# EAGLE schematic main (EAGLE 5.11)
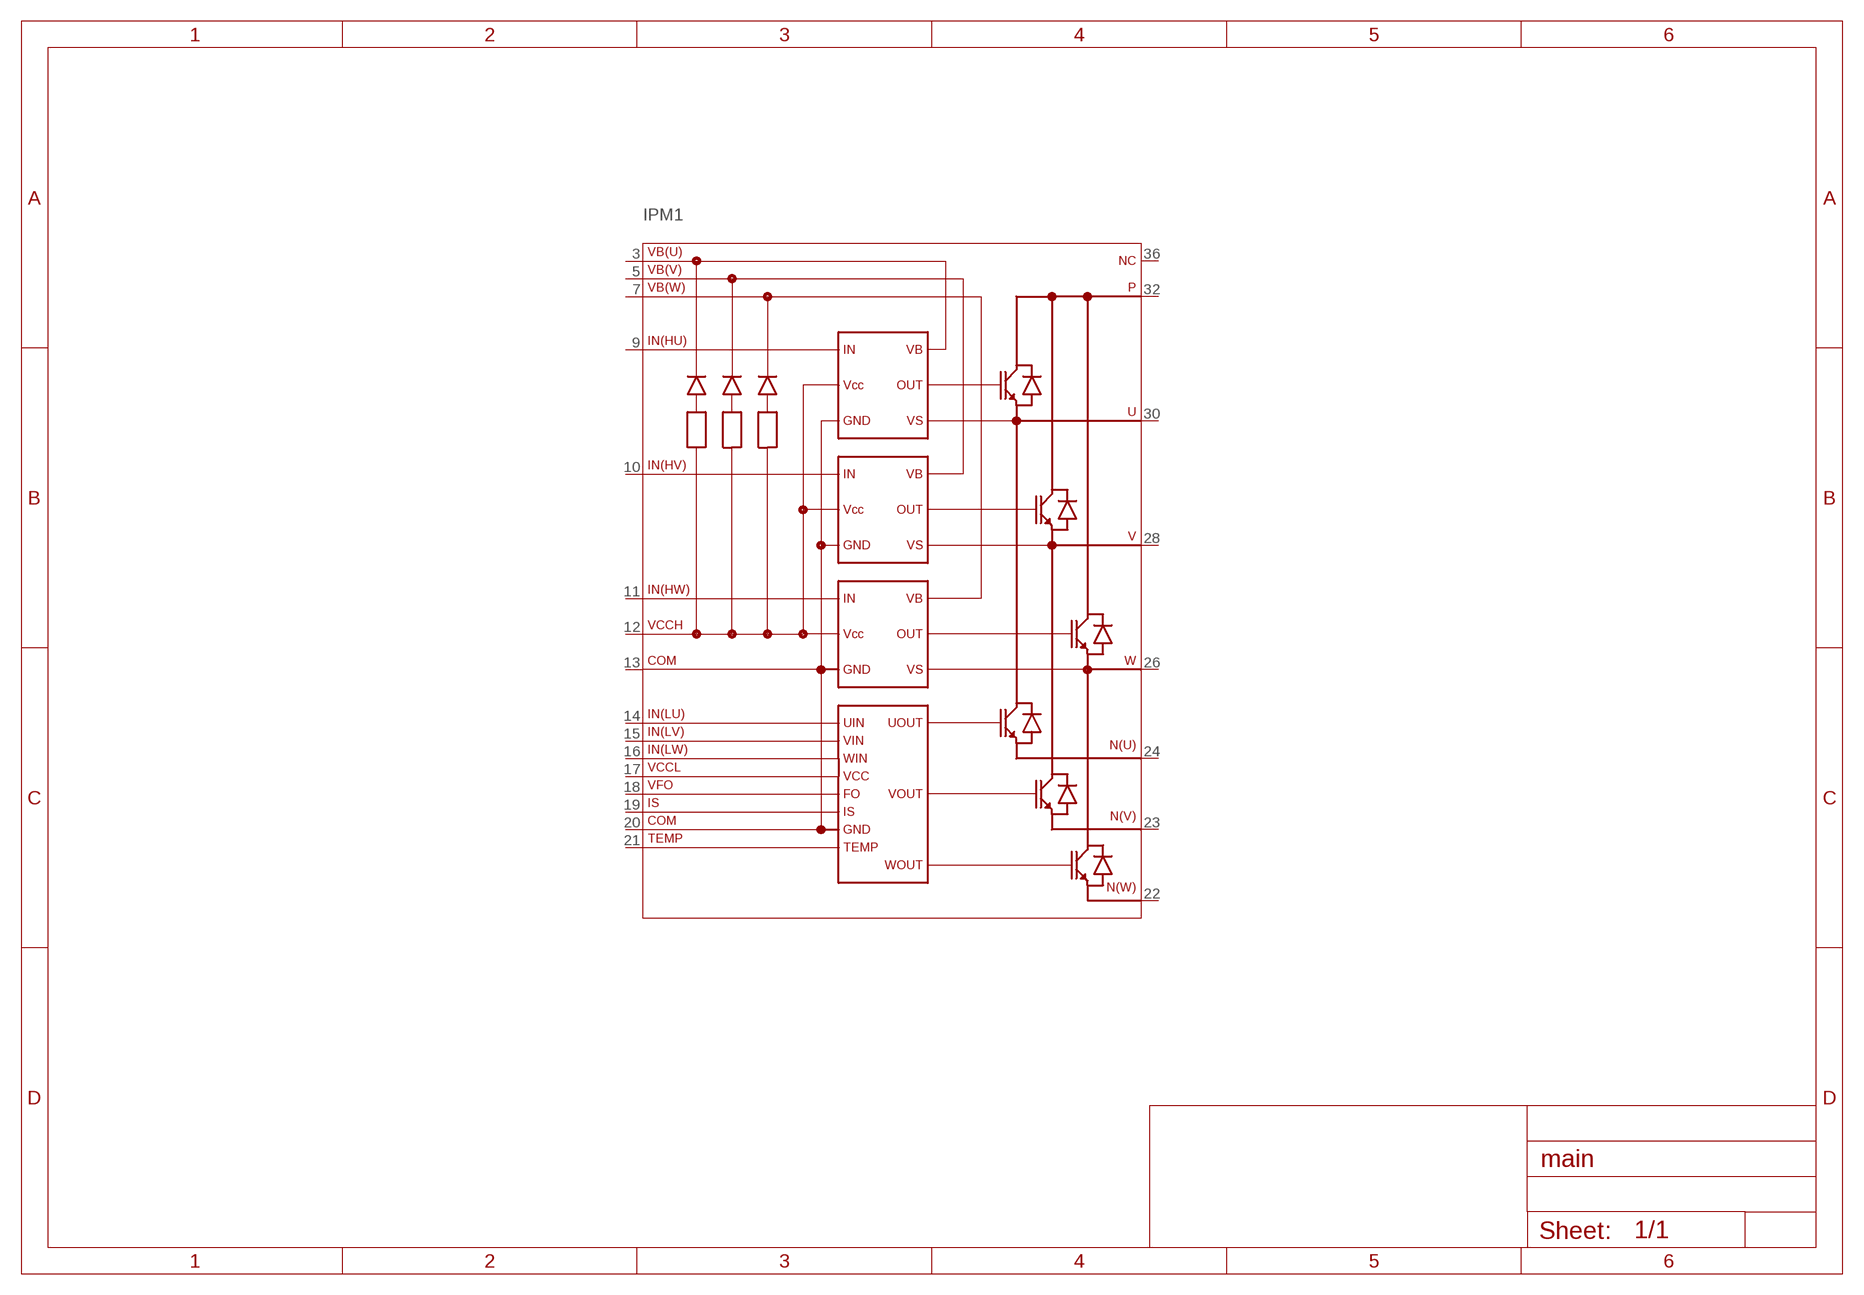
[diagram p0: schematic, sheet 1]

## Parts
IPM1  6MBP  [6MBPXXXSD060-50]
Unconnected: IPM1.9 IPM1.10 IPM1.11 IPM1.14 IPM1.15 IPM1.16 IPM1.18 IPM1.19 IPM1.20 IPM1.21 IPM1.26 IPM1.28 IPM1.30 IPM1.36

## Power pins joined to a net without a drawn wire
3: IPM1.3
5: IPM1.5
7: IPM1.7
12: IPM1.12
13: IPM1.13
17: IPM1.17
22: IPM1.22
23: IPM1.23
32: IPM1.32
P$24: IPM1.24

## Library data of the parts
IPM1 = myFujiElectric:6MBP*; X30SD060-50: X30SD060-50